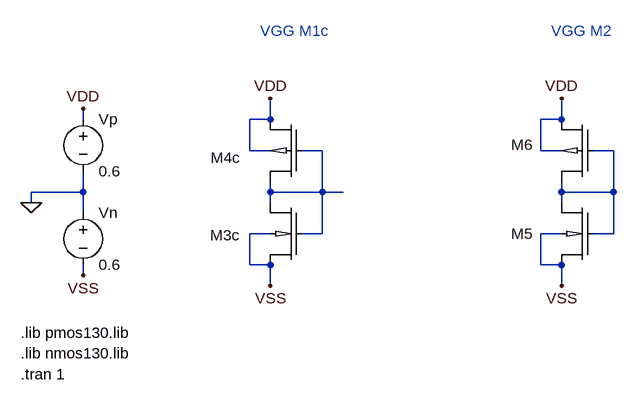
[diagram p0: schematic FiguraB_Questao4.asc]
FiguraB_Questao4.asc, the LTspice schematic file:
Version 4.1
SHEET 1 1004 680
WIRE 0 -160 0 -176
WIRE 288 -160 288 -192
WIRE 288 -160 256 -160
WIRE 736 -160 736 -192
WIRE 736 -160 704 -160
WIRE 256 -112 256 -160
WIRE 288 -112 256 -112
WIRE 368 -112 336 -112
WIRE 704 -112 704 -160
WIRE 736 -112 704 -112
WIRE 816 -112 784 -112
WIRE 0 -48 0 -80
WIRE 0 -48 -80 -48
WIRE 288 -48 288 -64
WIRE 368 -48 368 -112
WIRE 368 -48 288 -48
WIRE 400 -48 368 -48
WIRE 736 -48 736 -64
WIRE 816 -48 816 -112
WIRE 816 -48 736 -48
WIRE -80 -32 -80 -48
WIRE 288 -32 288 -48
WIRE 736 -32 736 -48
WIRE 0 -16 0 -48
WIRE 288 16 256 16
WIRE 368 16 368 -48
WIRE 368 16 336 16
WIRE 736 16 704 16
WIRE 816 16 816 -48
WIRE 816 16 784 16
WIRE 256 64 256 16
WIRE 288 64 256 64
WIRE 704 64 704 16
WIRE 736 64 704 64
WIRE 0 80 0 64
WIRE 288 96 288 64
WIRE 736 96 736 64
FLAG -80 -32 0
FLAG 0 80 VSS
FLAG 0 -176 VDD
FLAG 288 96 VSS
FLAG 288 -192 VDD
FLAG 736 96 VSS
FLAG 736 -192 VDD
DATAFLAG 400 -48 ""
DATAFLAG 816 -48 ""
SYMBOL voltage 0 -176 R0
WINDOW 123 0 0 Left 0
WINDOW 39 0 0 Left 0
SYMATTR InstName Vp
SYMATTR Value 0.6
SYMBOL voltage 0 -32 R0
WINDOW 123 0 0 Left 0
WINDOW 39 0 0 Left 0
SYMATTR InstName Vn
SYMATTR Value 0.6
SYMBOL nmos130 336 -32 M0
WINDOW 0 95 50 Left 2
WINDOW 3 56 72 Invisible 2
SYMATTR InstName M3c
SYMATTR SpiceLine width=600n length=10480n
SYMBOL pmos130 336 -64 R180
WINDOW 0 94 37 Left 2
WINDOW 3 56 72 Invisible 2
SYMATTR InstName M4c
SYMATTR SpiceLine width=1326n length=300n
SYMBOL pmos130 784 -64 R180
WINDOW 0 92 57 Left 2
WINDOW 3 56 72 Invisible 2
SYMATTR InstName M6
SYMATTR SpiceLine width=600n length=368n
SYMBOL nmos130 784 -32 M0
WINDOW 0 92 48 Left 2
WINDOW 3 56 72 Invisible 2
SYMATTR InstName M5
SYMATTR SpiceLine width=600n length=4929n
TEXT -96 168 Left 2 !.lib pmos130.lib
TEXT -96 200 Left 2 !.lib nmos130.lib
TEXT -96 232 Left 2 !.tran 1
TEXT 272 -296 Left 2 ;VGG M1c
TEXT 720 -296 Left 2 ;VGG M2

The netlist it stands for:
* FiguraB_Questao4.asc
Vp VDD 0 0.6
Vn 0 VSS 0.6
X§M3c N001 N001 VSS VSS nmos130 width=600n length=10480n  ; pins D G S B
X§M4c N001 N001 VDD VDD pmos130 width=1326n length=300n  ; pins D G S B
X§M6 N002 N002 VDD VDD pmos130 width=600n length=368n  ; pins D G S B
X§M5 N002 N002 VSS VSS nmos130 width=600n length=4929n  ; pins D G S B
.lib pmos130.lib
.lib nmos130.lib
.tran 1
* VGG M1c
* VGG M2
.backanno
.end